# Altium schematic sheet Power.SchDoc
size A4; SheetNumber: 4; SheetTotal: 10
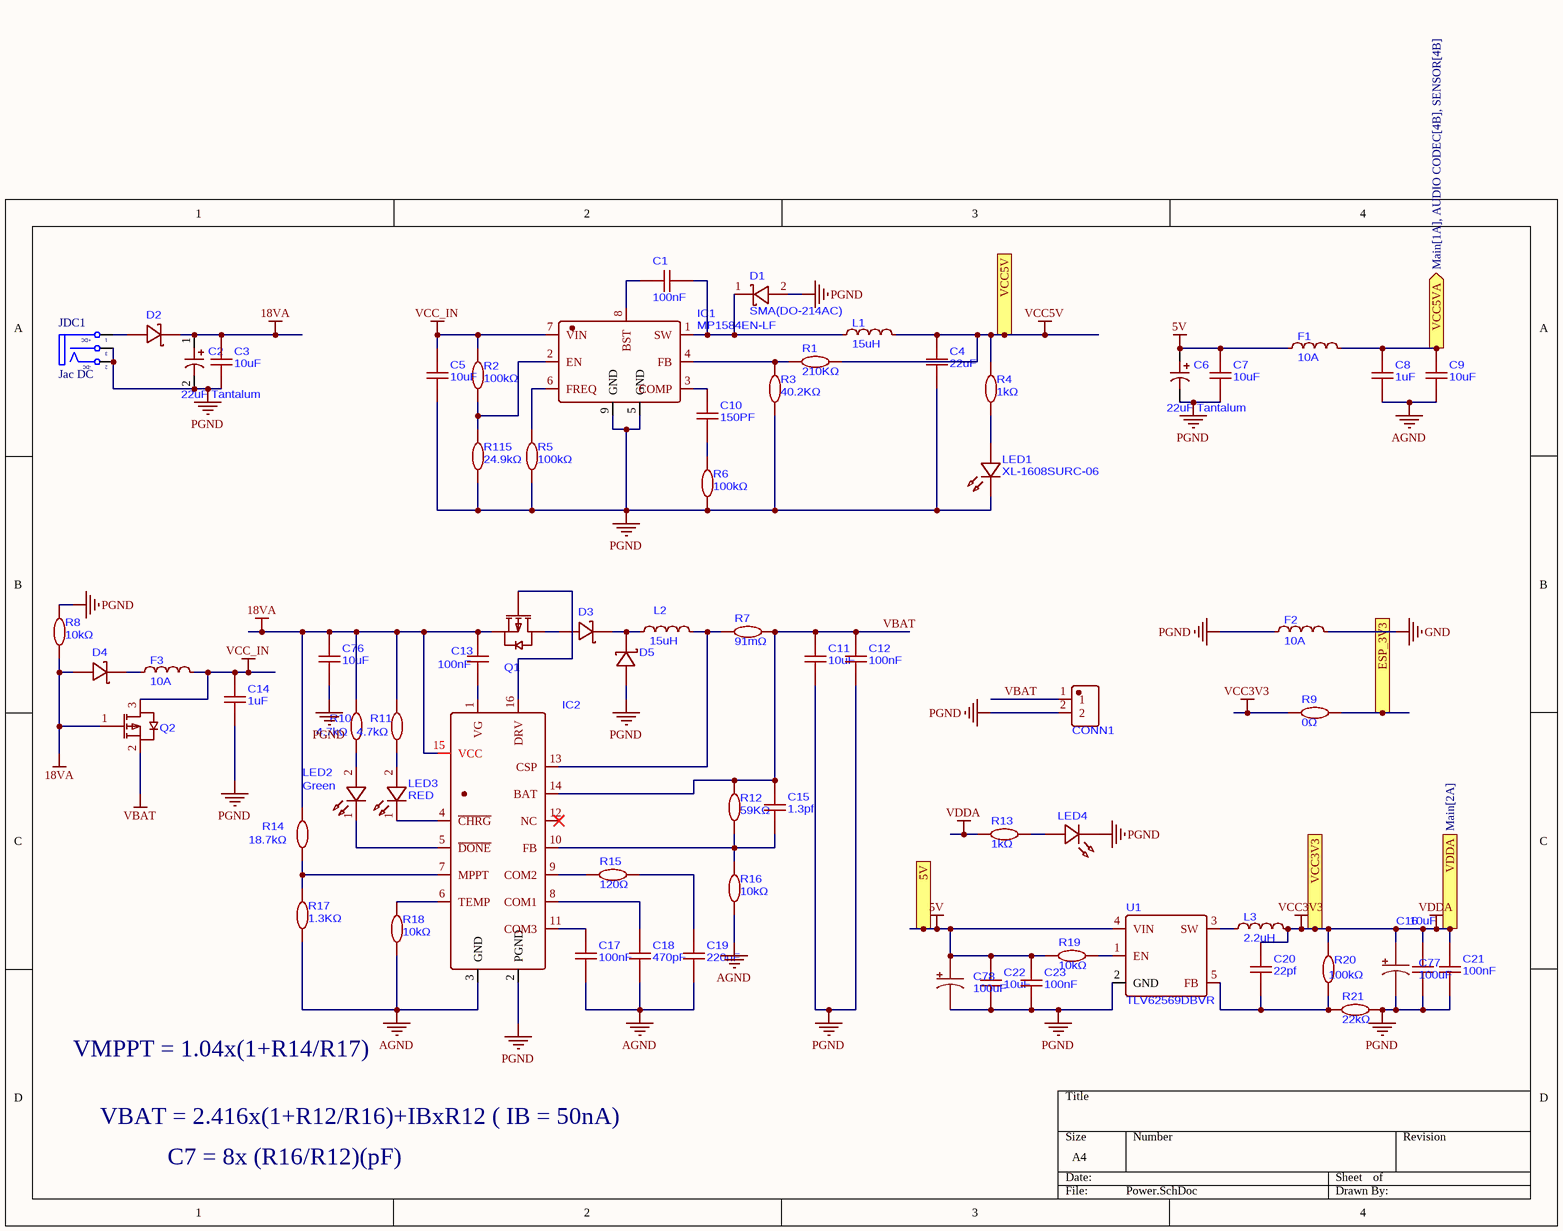
[diagram p0: Power.SchDoc]

## Parts
C1  100nF  [C0603]
C2  22uF Tantalum  [CAP-SMD_L7.3-W4.3-R-RD]
C3  10uF  [C0603]
C4  22uF  [C0603]
C5  10uF  [C0603]
C6  22uF Tantalum  [CAP-SMD_L7.3-W4.3-R-RD]
C7  10uF  [C0603]
C8  1uF  [C0603]
C9  10uF  [C0603]
C10  150PF  [C0603]
C11  10uF  [C0603]
C12  100nF  [C0603]
C13  100nF  [C0603]
C14  1uF  [C0603]
C15  1.3pf  [C0603]
C16  10uF  [C0603]
C17  100nF  [C0603]
C18  470pF  [C0603]
C19  220nF  [C0603]
C20  22pf  [C0603]
C21  100nF  [C0603]
C22  10uF  [C0603]
C23  100nF  [C0603]
C76  10uF  [C0603]
C77  100uF  [CAP-SMD_L3.5-W2.8-R-RD]
C78  100uF  [CAP-SMD_L3.5-W2.8-R-RD]
CONN1  TERM BLK 2POS 5mm TH  [CONN-TH_P5.00_KF128-5.0-2P]  (value not drawn)
D1  SMA(DO-214AC)  [SMA_L4.4-W2.6-LS5.0-RD]
D2  B540CQ-13-F  [SMC_L6.9-W5.9-LS7.9-RD]  (value not drawn)
D3  B540CQ-13-F  [SMC_L6.9-W5.9-LS7.9-RD]  (value not drawn)
D4  B540CQ-13-F  [SMC_L6.9-W5.9-LS7.9-RD]  (value not drawn)
D5  B540CQ-13-F  [SMC_L6.9-W5.9-LS7.9-RD]  (value not drawn)
F1  10A  [IND-SMD_L8.5-W3.1]
F2  10A  [IND-SMD_L8.5-W3.1]
F3  10A  [IND-SMD_L8.5-W3.1]
IC1  MP1584EN-LF  [SOIC-8_L4.9-W3.9-P1.27-LS6.0-BL-EP3.3]
IC2  5A TSSOP-16 Battery Management ROHS  [TSSOP-16_L5.0-W4.4-P0.65-LS6.4-BL]  (value not drawn)
JDC1  Jac DC  [DC-IN]
L1  15uH  [IND-SMD_L10.1-W10.0]
L2  15uH  [IND-SMD_L10.1-W10.0]
L3  2.2uH  [IND-SMD_L5.4-W5.2]
LED1  XL-1608SURC-06  [LED0603-RD_RED]
LED2  Green  [LED0603-RD_RED]
LED3  RED  [LED0603-RD_RED]
LED4  XL-1608SURC-06  [LED0603-RD_RED]  (value not drawn)
Q1  MOSFET P-CH 30V 4.3A SOT-23  [SOT-23-3_L2.9-W1.6-P1.90-LS2.8-BR]  (value not drawn)
Q2  MOSFET P-CH 30V 4.3A SOT-23  [SOT-23-3_L2.9-W1.6-P1.90-LS2.8-BR]  (value not drawn)
R1  210KΩ  [R0603]
R2  100kΩ  [R0603]
R3  40.2KΩ  [R0603]
R4  1kΩ  [R0603]
R5  100kΩ  [R0603]
R6  100kΩ  [R0603]
R7  91mΩ  [R1206]
R8  10kΩ  [R0603]
R9  0Ω  [R0603]
R10  4.7kΩ  [R0603]
R11  4.7kΩ  [R0603]
R12  59KΩ  [R0603]
R13  1kΩ  [R0603]
R14  18.7kΩ  [R0603]
R15  120Ω  [R0603]
R16  10kΩ  [R0603]
R17  1.3KΩ  [R0603]
R18  10kΩ  [R0603]
R19  10kΩ  [R0603]
R20  100kΩ  [R0603]
R21  22kΩ  [R0603]
R115  24.9kΩ  [R0603]
U1  TLV62569DBVR  [SOT-23-5_L3.0-W1.7-P0.95-LS2.8-BR]

## Ports
5V (in, see Main[2A], interfaceUART&I2C[2B], RELAY[1A], SOM[3A], USB[2D]), ESP_3V3 (out, see Main[2A], DSI&CSI CONNECTOR[3C], ETH-PHY[2A], interfaceUART&I2C[1C], SOM[6B]), VCC3V3 (out, see Main[2A], AUDIO CODEC[2C], SENSOR[3A], SOM[4A], USB[4C]), VCC5V (out, see Main[2A], USB[1D]), VCC5VA (out, see Main[1A], AUDIO CODEC[4B], SENSOR[4B]), VDDA (out, see Main[2A])

## Nets
5V: C6.1 C7.2 C22.2 C23.2 C78.1 F1.1 R19.1 U1.4(VIN) ; port 5V
18VA: C2.1 C3.2 C13.2 C76.2 D2.1(C) D4.2(A) IC2.15(VCC) Q1.2(S) Q2.1(G) R8.1 R10.2 R11.2 R14.2
AGND: C8.2 C9.1 C17.1 C18.1 C19.1 IC2.3(GND) R16.1 R17.1 R18.1
GND: F2.2
PGND: C2.2 C3.1 C4.1 C5.1 C6.2 C7.1 C11.1 C12.1 C14.2 C16.1 C21.1 C22.1 C23.1 C76.1 C77.2 C78.2 CONN1.2 D1.2(A) D5.2(A) F2.1 IC1.5(GND) IC1.9(GND) IC2.2(PGND) JDC1.2(TN) JDC1.3(S) LED1.1(K) LED4.1(K) R3.1 R5.1 R6.1 R8.2 R21.2 R115.1 U1.2(GND)
VBAT: C11.2 C12.2 C15.2 CONN1.1 IC2.14(BAT) Q2.2(S) R7.2 R12.2
VCC3V3: C16.2 C20.2 C21.2 C77.1 L3.2 R9.1 R13.2 R20.2 ; port VCC3V3, port VDDA  [also labelled VDDA]
VCC5V: C4.2 L1.2 R1.2 R4.2 ; port VCC5V
VCC_IN: C5.2 C14.1 F3.2 IC1.7(VIN) Q2.3(D) R2.2
ESP_3V3: R9.2 ; port ESP_3V3
VCC5VA: C8.1 C9.2 F1.2 ; port VCC5VA
NetC1_1: C1.1 IC1.8(BST)
NetC1_2: C1.2 D1.1(K) IC1.1(SW) L1.1
NetC10_1: C10.1 R6.2
NetC10_2: C10.2 IC1.3(COMP)
NetC13_1: C13.1 IC2.1(VG)
NetC15_1: C15.1 IC2.10(FB) R12.1 R16.2
NetC17_2: C17.2 IC2.11(COM3)
NetC18_2: C18.2 IC2.8(COM1)
NetC19_2: C19.2 R15.2
NetC20_1: C20.1 R20.1 R21.1 U1.5(FB)
NetD2_2: D2.2(A) JDC1.1(T)
NetD3_1: D3.1(C) D5.1(C) L2.1
NetD3_2: D3.2(A) Q1.3(D)
NetD4_1: D4.1(C) F3.1
NetIC1_2: IC1.2(EN) R2.1 R115.2
NetIC1_4: IC1.4(FB) R1.1 R3.2
NetIC1_6: IC1.6(FREQ) R5.2
NetIC2_4: IC2.4(~{CHRG}) LED3.1(K)
NetIC2_5: IC2.5(~{DONE}) LED2.1(K)
NetIC2_6: IC2.6(TEMP) R18.2
NetIC2_7: IC2.7(MPPT) R14.1 R17.2
NetIC2_9: IC2.9(COM2) R15.1
NetIC2_13: IC2.13(CSP) L2.2 R7.1
NetIC2_16: IC2.16(DRV) Q1.1(G)
NetL3_1: L3.1 U1.3(SW)
NetLED1_2: LED1.2(A) R4.1
NetLED2_2: LED2.2(A) R10.1
NetLED3_2: LED3.2(A) R11.1
NetLED4_2: LED4.2(A) R13.1
NetR19_2: R19.2 U1.1(EN)

Not connected (* = marked no-connect by the designer): IC2 12(NC)*

## Notes on the sheet
- VMPPT = 1.04x(1+R14/R17)
- VBAT = 2.416x(1+R12/R16)+IBxR12 ( IB = 50nA)
- C7 = 8x (R16/R12)(pF)
- (in symbol DCIN) +DC; -DC

## Library data of the parts
C1 C12 C13 C17 C21 C23 = CC0603KRX7R9BB104: 50V 100nF X7R ±10% 0603 Ceramic Capacitors ROHS
C2 C6 = T491X226K050AT: CAP TANT 22uF ±10% 50V CASE-X-7343-43(mm)
C3 C5 C7 C9 C11 C76 = CL10A106MA8NRNC: 25V 10uF X5R ±20% 0603 Ceramic Capacitors ROHS
C4 = CL10A226MP8NUNE: 10V 22uF X5R ±20% 0603 Ceramic Capacitors ROHS
C8 C14 = CL10B105KA8NNNC: 25V 1uF X7R ±10% 0603 Ceramic Capacitors ROHS
C10 = CC0603JRNPO9BN151: 50V 150pF NP0 ±5% 0603 Ceramic Capacitors ROHS
C15 = CC0603CRNPO9BN1R3: 50V 1.3pF NP0 0603 Ceramic Capacitors ROHS
C16 C22 = CL10A106KP8NNNC: 10V 10uF X5R ±10% 0603 Ceramic Capacitors ROHS
C18 = CL10C471JB8NNNC: 50V 470pF C0G ±5% 0603 Ceramic Capacitors ROHS
C19 = CL10B224KB8NNNC: 50V 220nF X7R ±10% 0603 Ceramic Capacitors ROHS
C20 = CL10C220JB8NNNC: 50V 22pF C0G ±5% 0603 Ceramic Capacitors RoHS
C77 C78 = CA45A-B-10V-100UF-K: 100uF 10V ±10% CASE-B-3528-19(mm) Tantalum Capacitors RoHS
CONN1 = KF128-5.0-2P: 2.5 1x2P 12~22 Green 24A -40℃~+105℃ 250V Through Hole 5mm 1 2 Through Hole,P=5mm Wire to Board RoHS
D1 = B340A-13-F: 80A 40V 500mV@3A 3A SMA(DO-214AC) Single Diodes ROHS
D2-D5 = B540CQ-13-F: 40V 550mV@5A 5A SMC(DO-214AB) Single Diodes ROHS
F1-F3 = HI3312X101R-10: 4mΩ 100Ω@100MHz SMD,8.5x3.1mm Ferrite Beads and Chips ROHS
IC1 = MP1584EN-LF: Buck Switching Regulator IC
IC2 = CN3722: Multi-type battery charging management integrated circuit with maximum power point tracking function for solar cells
JDC1 = DCIN: Jac DC input; Value: Jac DC
L1 L2 = YDRH105R-150M: 3.4A 15uH Magnetic Shielded Inductor ±20% 41mΩ SMD,10.1x10.1mm Fixed Inductors ROHS
L3 = APH0530T2R2M: 7A 2.2uH Molded Inductor ±20% 7A 29mΩ SMD,5.4x5.2mm Fixed Inductors RoHS
LED1 LED3 LED4 = XL-1608SURC-06: 20mA 2.3V Red 50mW 0603 LED Indication - Discrete ROHS
LED2 = D-060306G1/SS2/G1: 5mA 500mcd 526nm~532nm Green 70mW 2.8V 0603 LED Indication - Discrete ROHS
Q1 Q2 = AO3407A: 30V 4.3A 48mΩ@10V 2.5V@250uA 1 P-Channel SOT-23 Single FETs, MOSFETs ROHS
R1 = 0603WAF2103T5E: 100mW 210kΩ 75V ±100ppm/℃ Thick Film Resistor ±1% 0603 Chip Resistor - Surface Mount ROHS
R2 R5 R6 R20 = RC0603FR-07100KL: 100mW 100kΩ 75V ±100ppm/℃ Thick Film Resistor ±1% 0603 Chip Resistor - Surface Mount ROHS
R3 = RT0603BRD0740K2L: 40.2kΩ 100mW 75V ±25ppm/℃ Thin Film Resistor ±0.1% 0603 Chip Resistor - Surface Mount ROHS
R4 R13 = RMC 0603 1K J N: 100mW 1kΩ 50V ±100ppm/℃ Thick Film Resistor ±5% 0603 Chip Resistor - Surface Mount ROHS
R7 = FRL1206FR091TS: 250mW 91mΩ 500V ±600ppm/℃ Thick Film Resistor ±1% 1206 Chip Resistor - Surface Mount ROHS
R8 R16 R18 R19 = RC0603FR-0710KL: 100mW 10kΩ 75V ±100ppm/℃ Thick Film Resistor ±1% 0603 Chip Resistor - Surface Mount ROHS
R9 = RC0603JR-070RL: 100mW 0Ω 75V Thick Film Resistor ±5% 0603 Chip Resistor - Surface Mount RoHS
R10 R11 = RC0603FR-074K7L: 100mW 4.7kΩ 75V ±100ppm/℃ Thick Film Resistor ±1% 0603 Chip Resistor - Surface Mount ROHS
R12 = FRC0603F5902TS: 100mW 59kΩ 75V ±100ppm/℃ Thick Film Resistor ±1% 0603 Chip Resistor - Surface Mount ROHS
R14 = FRC0603F1872TS: 100mW 18.7kΩ 75V ±100ppm/℃ Thick Film Resistor ±1% 0603 Chip Resistor - Surface Mount ROHS
R15 = 0603WAF1200T5E: 100mW 120Ω 75V ±100ppm/℃ Thick Film Resistor ±1% 0603 Chip Resistor - Surface Mount ROHS
R17 = RT0603BRD071K3L: 100mW 1.3kΩ 75V ±25ppm/℃ Thin Film Resistor ±0.1% 0603 Chip Resistor - Surface Mount ROHS
R21 = RC0603FR-0722KL: 100mW 22kΩ 75V ±100ppm/℃ Thick Film Resistor ±1% 0603 Chip Resistor - Surface Mount RoHS
R115 = 0603WAF2492T5E: 1100mW 24.9kΩ 75V ±100ppm/℃ Thick Film Resistor ±1% 0603 Chip Resistor - Surface Mount ROHS
U1 = TLV62569DBVR: 1.5MHz 2A Buck Adjustable 600mV~5.5V 1 SOT-23-5 Voltage Regulators - DC DC Switching Regulators RoHS